# EAGLE schematic TMC2209_Circuit_v11 (EAGLE 9.7.0)
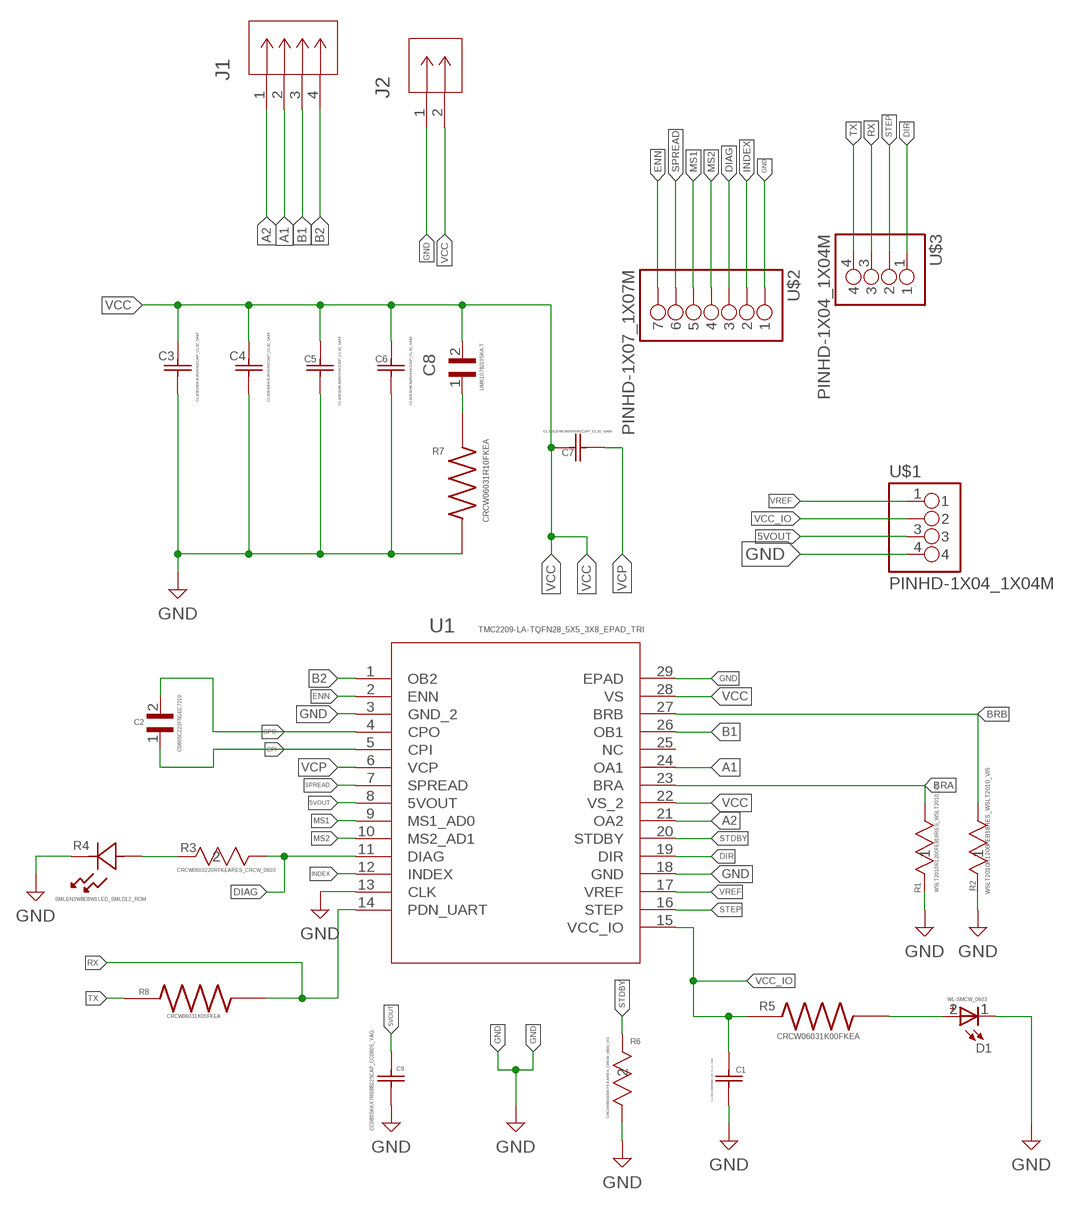
[diagram p0: schematic, sheet 1]

## Parts
C1  CL10B104KB8NNNCCAP_CL10_SAM  [CAP_CL10_SAM]
C2  C0805C223F5GEC7210  [CAPC2012X120N]
C3  CL32B106KBJNNNECAP_CL32_SAM  [CAP_CL32_SAM]
C4  CL32B106KBJNNNECAP_CL32_SAM  [CAP_CL32_SAM]
C5  CL10B104KB8NNNCCAP_CL10_SAM  [CAP_CL10_SAM]
C6  CL10B104KB8NNNCCAP_CL10_SAM  [CAP_CL10_SAM]
C7  CL10B104KB8NNNCCAP_CL10_SAM  [CAP_CL10_SAM]
C8  UMK107BJ105KA-T  [CAPC1608X90N]
C9  CC0805KKX7R9BB225CAP_CC0805_YAG  [CAP_CC0805_YAG]
D1  WL-SMCW_0603  [WL-SMCW_0603]
J1  S4B-XH-A(LF)(SN)CONN_S4B-XH-A(LF)(SN)_JST  [CONN_S4B-XH-A(LF)(SN)_JST]
J2  S2B-PH-K-S(LF)(SN)CONN_S2B-PH-K-S_JST  [CONN_S2B-PH-K-S_JST]
R1  WSLT2010R1200FEB18RES_WSLT2010_VIS  [RES_WSLT2010_VIS]
R2  WSLT2010R1200FEB18RES_WSLT2010_VIS  [RES_WSLT2010_VIS]
R3  CRCW0603220RFKEARES_CRCW_0603  [RES_CRCW_0603]
R4  SMLEN3WBC8W1LED_SMLD12_ROM  [LED_SMLD12_ROM]
R5  CRCW06031K00FKEA  [RESC1508X50N]
R6  CRCW0603100KFKEARES_CRCW_0603_VIS  [RES_CRCW_0603_VIS]
R7  CRCW06031R10FKEA  [RESC1508X50N]
R8  CRCW06031K00FKEA  [RESC1508X50N]
U1  TMC2209-LA-TQFN28_5X5_3X8_EPAD_TRI  [QFN28_5X5_3X8_EPAD_TRI]
U$1  PINHD-1X04_1X04M  [1X04]
U$2  PINHD-1X07_1X07M  [1X07]
U$3  PINHD-1X04_1X04M  [1X04]

## Nets
5VOUT: C9.1 U1.8(5VOUT) U$1.3
A1: J1.2 U1.24(OA1)
A2: J1.1 U1.21(OA2)
B1: J1.3 U1.26(OB1)
B2: J1.4 U1.1(OB2)
BRA: R1.2 U1.23(BRA)
BRB: R2.2 U1.27(BRB)
CPI: C2.1 U1.5(CPI)
CPO: C2.2 U1.4(CPO)
DIAG: R3.1 U1.11(DIAG) U$2.3
DIR: U1.19(DIR) U$3.1
ENN: U1.2(ENN) U$2.7
GND: C1.2 C3.1 C4.1 C5.1 C6.1 C9.2 D1.1(-) J2.1 R1.1 R2.1 R4.1 R6.1 R7.1 U1.3(GND_2) U1.13(CLK) U1.18(GND) U1.29(EPAD) U$1.4 U$2.1
INDEX: U1.12(INDEX) U$2.2
MS1: U1.9(MS1_AD0) U$2.5
MS2: U1.10(MS2_AD1) U$2.4
N$4: R3.2 R4.2
N$6: D1.2(+) R5.2
N$10: C8.1 R7.2
RX: R8.2 U1.14(PDN_UART) U$3.3
SPREAD: U1.7(SPREAD) U$2.6
STDBY: R6.2 U1.20(STDBY)
STEP: U1.16(STEP) U$3.2
TX: R8.1 U$3.4
VCC: C3.2 C4.2 C5.2 C6.2 C7.2 C8.2 J2.2 U1.22(VS_2) U1.28(VS)
VCC_IO: C1.1 R5.1 U1.15(VCC_IO) U$1.2
VCP: C7.1 U1.6(VCP)
VREF: U1.17(VREF) U$1.1
Unconnected: U1.25(NC)

## Library data of the parts
C1 C5-C7 = 100nF_Cap:CL10B104KB8NNNC; COPYRIGHT: Copyright (C) 2025 Ultra Librarian. All rights reserved.; MANUFACTURER_PART_NUMBER: CL10B104KB8NNNC; MFR_NAME: Samsung
C2 = C0805C223F5GEC7210:C0805C223F5GEC7210
C3 C4 = 10uF:CL32B106KBJNNNE; COPYRIGHT: Copyright (C) 2025 Ultra Librarian. All rights reserved.; MANUFACTURER_PART_NUMBER: CL32B106KBJNNNE; MFR_NAME: Samsung
C8 = UMK107BJ105KA-T:UMK107BJ105KA-T
C9 = 2.2uF:CC0805KKX7R9BB225; COPYRIGHT: Copyright (C) 2025 Ultra Librarian. All rights reserved.; MANUFACTURER_PART_NUMBER: CC0805KKX7R9BB225; MFR_NAME: Yageo
D1 = WL-SMCW_0603BLED:WL-SMCW_0603
J1 = 2025-03-22_04-32-02_Library:S4B-XH-A(LF)(SN); COPYRIGHT: Copyright (C) 2025 Ultra Librarian. All rights reserved.; MANUFACTURER_PART_NUMBER: S4B-XH-A(LF)(SN); MFR_NAME: JST
J2 = 2025-03-22_04-08-40_Library:S2B-PH-K-S(LF)(SN); COPYRIGHT: Copyright (C) 2025 Ultra Librarian. All rights reserved.; MANUFACTURER_PART_NUMBER: S2B-PH-K-S(LF)(SN); MFR_NAME: JST
R1 R2 = res.12ohm:WSLT2010R1200FEB18; COPYRIGHT: Copyright (C) 2025 Ultra Librarian. All rights reserved.; MANUFACTURER_PART_NUMBER: WSLT2010R1200FEB18; MFR_NAME: Vishay
R3 = 220R:CRCW0603220RFKEA; COPYRIGHT: Copyright (C) 2025 Ultra Librarian. All rights reserved.; MANUFACTURER_PART_NUMBER: CRCW0603220RFKEA; MFR_NAME: Vishay
R4 = 2025-03-23_04-23-12_Library:SMLEN3WBC8W1; COPYRIGHT: Copyright (C) 2025 Ultra Librarian. All rights reserved.; MANUFACTURER_PART_NUMBER: SMLEN3WBC8W1; MFR_NAME: ROHM Semiconductor
R5 R8 = CRCW06031K00FKEA:CRCW06031K00FKEA
R6 = 2025-03-22_00-16-48_Library:CRCW0603100KFKEA; COPYRIGHT: Copyright (C) 2025 Ultra Librarian. All rights reserved.; MANUFACTURER_PART_NUMBER: CRCW0603100KFKEA; MFR_NAME: Vishay
R7 = CRCW06031R10FKEA:CRCW06031R10FKEA
U1 = TMC2209_NewFootprint:TMC2209-LA-T; COPYRIGHT: Copyright (C) 2025 Ultra Librarian. All rights reserved.; MANUFACTURER_PART_NUMBER: TMC2209-LA-T; MFR_NAME: Analog Devices / Trinamic
U$1 U$3 = Tinkercad:PINHD-1X04
U$2 = Tinkercad:PINHD-1X07